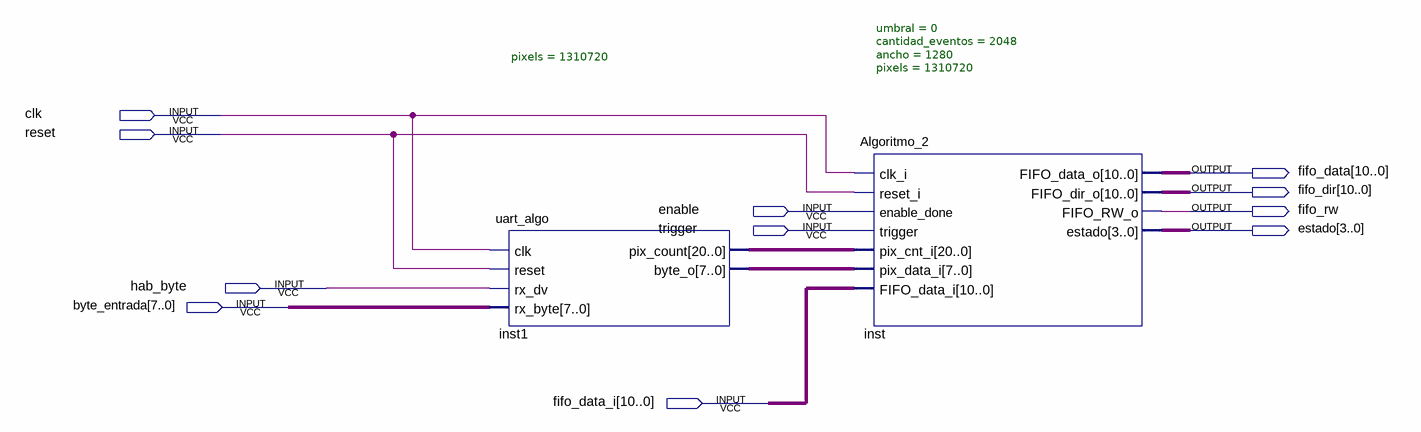
[diagram p0: schematic sheet]
// Quartus schematic test_algo_sim.bdf as structural Verilog: 2 symbols, 11 pins
module test_algo_sim (
  input  clk,
  input  reset,
  input  enable,
  input  trigger,
  input  hab_byte,
  input  [7:0] byte_entrada,
  input  [10:0] fifo_data_i,
  output [10:0] fifo_data,
  output [10:0] fifo_dir,
  output fifo_rw,
  output [3:0] estado
);

  wire [7:0] inst1_byte_o;
  wire [20:0] inst1_pix_count;

  uart_algo #(.pixels(1310720)) inst1 (
    .clk(clk), .reset(reset), .rx_dv(hab_byte), .rx_byte(byte_entrada), .pix_count(inst1_pix_count),
    .byte_o(inst1_byte_o));
  Algoritmo_2 #(.umbral(0), .cantidad_eventos(2048), .ancho(1280), .pixels(1310720)) inst (
    .clk_i(clk), .reset_i(reset), .enable_done(enable), .trigger(trigger), .pix_cnt_i(inst1_pix_count),
    .pix_data_i(inst1_byte_o), .FIFO_data_i(fifo_data_i), .FIFO_data_o(fifo_data), .FIFO_dir_o(fifo_dir),
    .FIFO_RW_o(fifo_rw), .estado(estado));
endmodule
